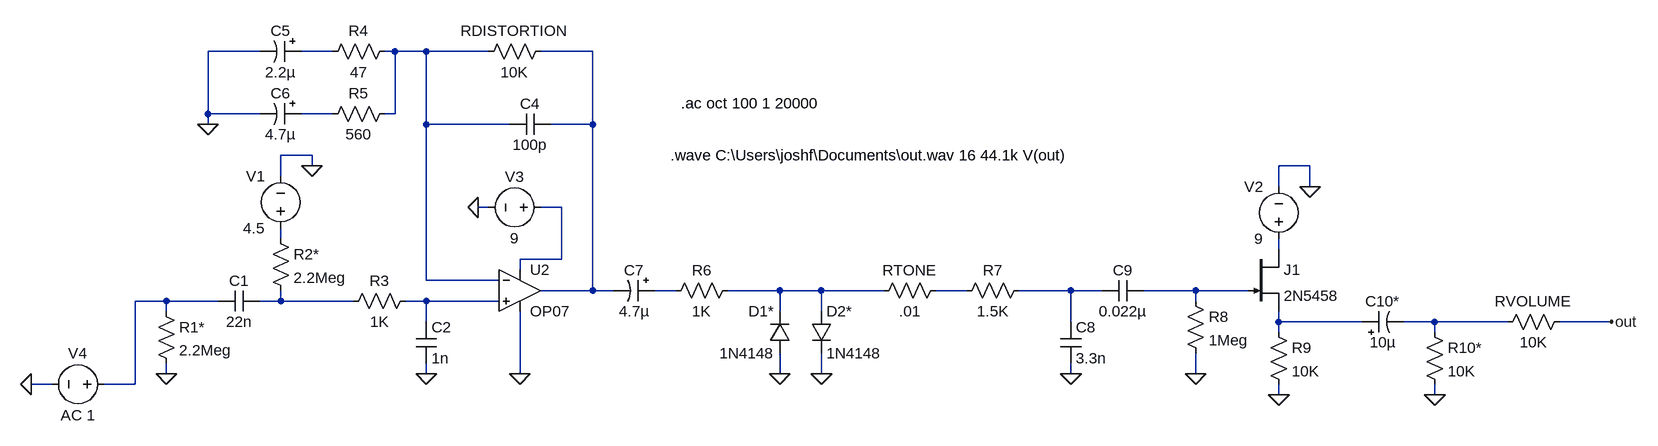
[diagram p0: schematic ProCo RAT Schematic.asc]
ProCo RAT Schematic.asc, the LTspice schematic file:
Version 4
SHEET 1 2396 680
WIRE 128 -128 48 -128
WIRE 240 -128 192 -128
WIRE 336 -128 320 -128
WIRE 384 -128 336 -128
WIRE 480 -128 384 -128
WIRE 640 -128 560 -128
WIRE 48 -32 48 -128
WIRE 128 -32 48 -32
WIRE 240 -32 192 -32
WIRE 336 -32 336 -128
WIRE 336 -32 320 -32
WIRE 48 -16 48 -32
WIRE 384 -16 384 -128
WIRE 512 -16 384 -16
WIRE 640 -16 640 -128
WIRE 640 -16 576 -16
WIRE 208 32 160 32
WIRE 208 48 208 32
WIRE 1744 48 1696 48
WIRE 160 64 160 32
WIRE 1696 80 1696 48
WIRE 1744 80 1744 48
WIRE 480 112 464 112
WIRE 592 112 560 112
WIRE 160 160 160 144
WIRE 1696 176 1696 160
WIRE 592 192 592 112
WIRE 592 192 528 192
WIRE 528 208 528 192
WIRE 384 224 384 -16
WIRE 496 224 384 224
WIRE 640 240 640 -16
WIRE 640 240 560 240
WIRE 672 240 640 240
WIRE 768 240 736 240
WIRE 928 240 848 240
WIRE 992 240 928 240
WIRE 1088 240 992 240
WIRE 1216 240 1168 240
WIRE 1376 240 1296 240
WIRE 1424 240 1376 240
WIRE 1568 240 1488 240
WIRE 1648 240 1568 240
WIRE -16 256 -64 256
WIRE 64 256 -16 256
WIRE 160 256 160 240
WIRE 160 256 128 256
WIRE 272 256 160 256
WIRE 384 256 352 256
WIRE 496 256 384 256
WIRE 1568 256 1568 240
WIRE -16 272 -16 256
WIRE 928 272 928 240
WIRE 992 272 992 240
WIRE 384 288 384 256
WIRE 1376 288 1376 240
WIRE 1696 288 1696 272
WIRE 1824 288 1696 288
WIRE 1936 288 1888 288
WIRE 2048 288 1936 288
WIRE 2208 288 2128 288
WIRE 1696 304 1696 288
WIRE 1936 304 1936 288
WIRE -16 368 -16 352
WIRE 384 368 384 352
WIRE 528 368 528 272
WIRE 928 368 928 336
WIRE 992 368 992 336
WIRE 1376 368 1376 352
WIRE 1568 368 1568 336
WIRE -192 384 -224 384
WIRE -64 384 -64 256
WIRE -64 384 -112 384
WIRE 1696 400 1696 384
WIRE 1936 400 1936 384
FLAG -16 368 0
FLAG 208 48 0
FLAG 384 368 0
FLAG 48 -16 0
FLAG 928 368 0
FLAG 992 368 0
FLAG 1376 368 0
FLAG 1568 368 0
FLAG 1744 80 0
FLAG 1696 400 0
FLAG 528 368 0
FLAG 464 112 0
FLAG 1936 400 0
FLAG -224 384 0
FLAG 2208 288 out
SYMBOL res -32 256 R0
SYMATTR InstName R1*
SYMATTR Value 2.2Meg
SYMATTR SpiceLine tol=1 pwr=0.1
SYMBOL cap 128 240 R90
WINDOW 0 0 32 VBottom 2
WINDOW 3 32 32 VTop 2
SYMATTR InstName C1
SYMATTR Value 22n
SYMATTR SpiceLine V=16 Irms=322m Rser=0.472482 Lser=0 mfg="KEMET" pn="C0603C223K4RAC" type="X7R"
SYMBOL res 144 144 R0
SYMATTR InstName R2*
SYMATTR Value 2.2Meg
SYMBOL voltage 160 160 R180
WINDOW 0 24 96 Left 2
WINDOW 3 24 16 Left 2
WINDOW 123 0 0 Left 0
WINDOW 39 0 0 Left 0
SYMATTR InstName V1
SYMATTR Value 4.5
SYMBOL res 368 240 R90
WINDOW 0 0 56 VBottom 2
WINDOW 3 32 56 VTop 2
SYMATTR InstName R3
SYMATTR Value 1K
SYMATTR SpiceLine tol=1 pwr=0.1
SYMBOL cap 368 288 R0
SYMATTR InstName C2
SYMATTR Value 1n
SYMATTR SpiceLine V=6.3 Irms=25.7m Rser=3.62516 Lser=0 mfg="KEMET" pn="C0402C102K9RAC" type="X7R"
SYMBOL cap 576 -32 R90
WINDOW 0 0 32 VBottom 2
WINDOW 3 32 32 VTop 2
SYMATTR InstName C4
SYMATTR Value 100p
SYMATTR SpiceLine V=25 Irms=0 Rser=0 Lser=0 mfg="Murata" pn="GRM0335C1E101JA01" type="C0G"
SYMBOL res 336 -144 R90
WINDOW 0 0 56 VBottom 2
WINDOW 3 32 56 VTop 2
SYMATTR InstName R4
SYMATTR Value 47
SYMBOL res 336 -48 R90
WINDOW 0 0 56 VBottom 2
WINDOW 3 32 56 VTop 2
SYMATTR InstName R5
SYMATTR Value 560
SYMBOL polcap 192 -144 R90
WINDOW 0 0 32 VBottom 2
WINDOW 3 32 32 VTop 2
SYMATTR InstName C5
SYMATTR Value 2.2µ
SYMBOL polcap 192 -48 R90
WINDOW 0 0 32 VBottom 2
WINDOW 3 32 32 VTop 2
SYMATTR InstName C6
SYMATTR Value 4.7µ
SYMBOL polcap 736 224 R90
WINDOW 0 0 32 VBottom 2
WINDOW 3 32 32 VTop 2
SYMATTR InstName C7
SYMATTR Value 4.7µ
SYMBOL res 864 224 R90
WINDOW 0 0 56 VBottom 2
WINDOW 3 32 56 VTop 2
SYMATTR InstName R6
SYMATTR Value 1K
SYMBOL diode 944 336 R180
WINDOW 0 24 64 Left 2
WINDOW 3 24 0 Left 2
SYMATTR InstName D1*
SYMATTR Value 1N4148
SYMBOL diode 976 272 R0
SYMATTR InstName D2*
SYMATTR Value 1N4148
SYMBOL res 1312 224 R90
WINDOW 0 0 56 VBottom 2
WINDOW 3 32 56 VTop 2
SYMATTR InstName R7
SYMATTR Value 1.5K
SYMBOL cap 1360 288 R0
SYMATTR InstName C8
SYMATTR Value 3.3n
SYMATTR SpiceLine V=6.3 Irms=84.3m Rser=1.77579 Lser=0 mfg="KEMET" pn="C0603C332K9RAC" type="X7R"
SYMBOL cap 1488 224 R90
WINDOW 0 0 32 VBottom 2
WINDOW 3 32 32 VTop 2
SYMATTR InstName C9
SYMATTR Value 0.022µ
SYMATTR SpiceLine V=4 Irms=356m Rser=0.150334 Lser=0 mfg="KEMET" pn="C0402C223K7PAC" type="X5R"
SYMBOL res 1552 240 R0
SYMATTR InstName R8
SYMATTR Value 1Meg
SYMBOL njf 1648 176 R0
SYMATTR InstName J1
SYMATTR Value 2N5458
SYMBOL voltage 1696 176 R180
WINDOW 0 24 96 Left 2
WINDOW 3 24 16 Left 2
WINDOW 123 0 0 Left 0
WINDOW 39 0 0 Left 0
SYMATTR InstName V2
SYMATTR Value 9
SYMBOL res 1680 288 R0
SYMATTR InstName R9
SYMATTR Value 10K
SYMBOL polcap 1824 304 R270
WINDOW 0 32 32 VTop 2
WINDOW 3 0 32 VBottom 2
SYMATTR InstName C10*
SYMATTR Value 10µ
SYMBOL OpAmps\\OP07 528 176 R0
SYMATTR InstName U2
SYMBOL voltage 576 112 R90
WINDOW 0 -32 56 VBottom 2
WINDOW 3 32 56 VTop 2
WINDOW 123 0 0 Left 0
WINDOW 39 0 0 Left 0
SYMATTR InstName V3
SYMATTR Value 9
SYMBOL res 1920 288 R0
SYMATTR InstName R10*
SYMATTR Value 10K
SYMBOL voltage -96 384 R90
WINDOW 0 -32 56 VBottom 2
WINDOW 3 32 56 VTop 2
WINDOW 123 0 0 Left 0
WINDOW 39 0 0 Left 0
SYMATTR InstName V4
SYMATTR Value AC 1
SYMBOL res 576 -144 R90
WINDOW 0 0 56 VBottom 2
WINDOW 3 32 56 VTop 2
SYMATTR InstName RDISTORTION
SYMATTR Value 10K
SYMBOL res 1184 224 R90
WINDOW 0 0 56 VBottom 2
WINDOW 3 32 56 VTop 2
SYMATTR InstName RTONE
SYMATTR Value .01
SYMBOL res 2144 272 R90
WINDOW 0 0 56 VBottom 2
WINDOW 3 32 56 VTop 2
SYMATTR InstName RVOLUME
SYMATTR Value 10K
TEXT 760 32 Left 2 !.wave C:\\Users\\joshf\\Documents\\out.wav 16 44.1k V(out)
TEXT 776 -48 Left 2 !.ac oct 100 1 20000

The netlist it stands for:
* ProCo RAT Schematic.asc
R1* N013 0 2.2Meg tol=1 pwr=0.1
C1 N014 N013 22n V=16 Irms=322m Rser=0.472482 Lser=0 mfg="KEMET" pn="C0603C223K4RAC" type="X7R"
R2* N006 N014 2.2Meg
V1 N006 0 4.5
R3 N015 N014 1K tol=1 pwr=0.1
C2 N015 0 1n V=6.3 Irms=25.7m Rser=3.62516 Lser=0 mfg="KEMET" pn="C0402C102K9RAC" type="X7R"
C4 N003 N002 100p V=25 Irms=0 Rser=0 Lser=0 mfg="Murata" pn="GRM0335C1E101JA01" type="C0G"
R4 N002 N001 47
R5 N002 N004 560
C5 N001 0 2.2µ
C6 N004 0 4.7µ
C7 N008 N003 4.7µ
R6 N009 N008 1K
D1* 0 N009 1N4148
D2* N009 0 1N4148
R7 N011 N010 1.5K
C8 N011 0 3.3n V=6.3 Irms=84.3m Rser=1.77579 Lser=0 mfg="KEMET" pn="C0603C332K9RAC" type="X7R"
C9 N012 N011 0.022µ V=4 Irms=356m Rser=0.150334 Lser=0 mfg="KEMET" pn="C0402C223K7PAC" type="X5R"
R8 N012 0 1Meg
J1 N007 N012 N016 2N5458
V2 N007 0 9
R9 N016 0 10K
C10* N016 N017 10µ
XU2 N015 N002 N005 0 N003 LT1001  ; OP07, pins In+ In- V+ V- OUT
V3 N005 0 9
R10* N017 0 10K
V4 N013 0 AC 1
RDISTORTION N003 N002 10K
RTONE N010 N009 .01
RVOLUME out N017 10K
.model D D
.lib standard.dio
.model NJF NJF
.model PJF PJF
.lib standard.jft
.wave C:\Users\joshf\Documents\out.wav 16 44.1k V(out)
.ac oct 100 1 20000
.lib LTC.lib
.backanno
.end